# Altium schematic sheet ST_LINK_V2.SCHDOC
size A4; DocumentNumber: 2; Revision: C.1(PCB.SCH); SheetNumber: 2; SheetTotal: 4
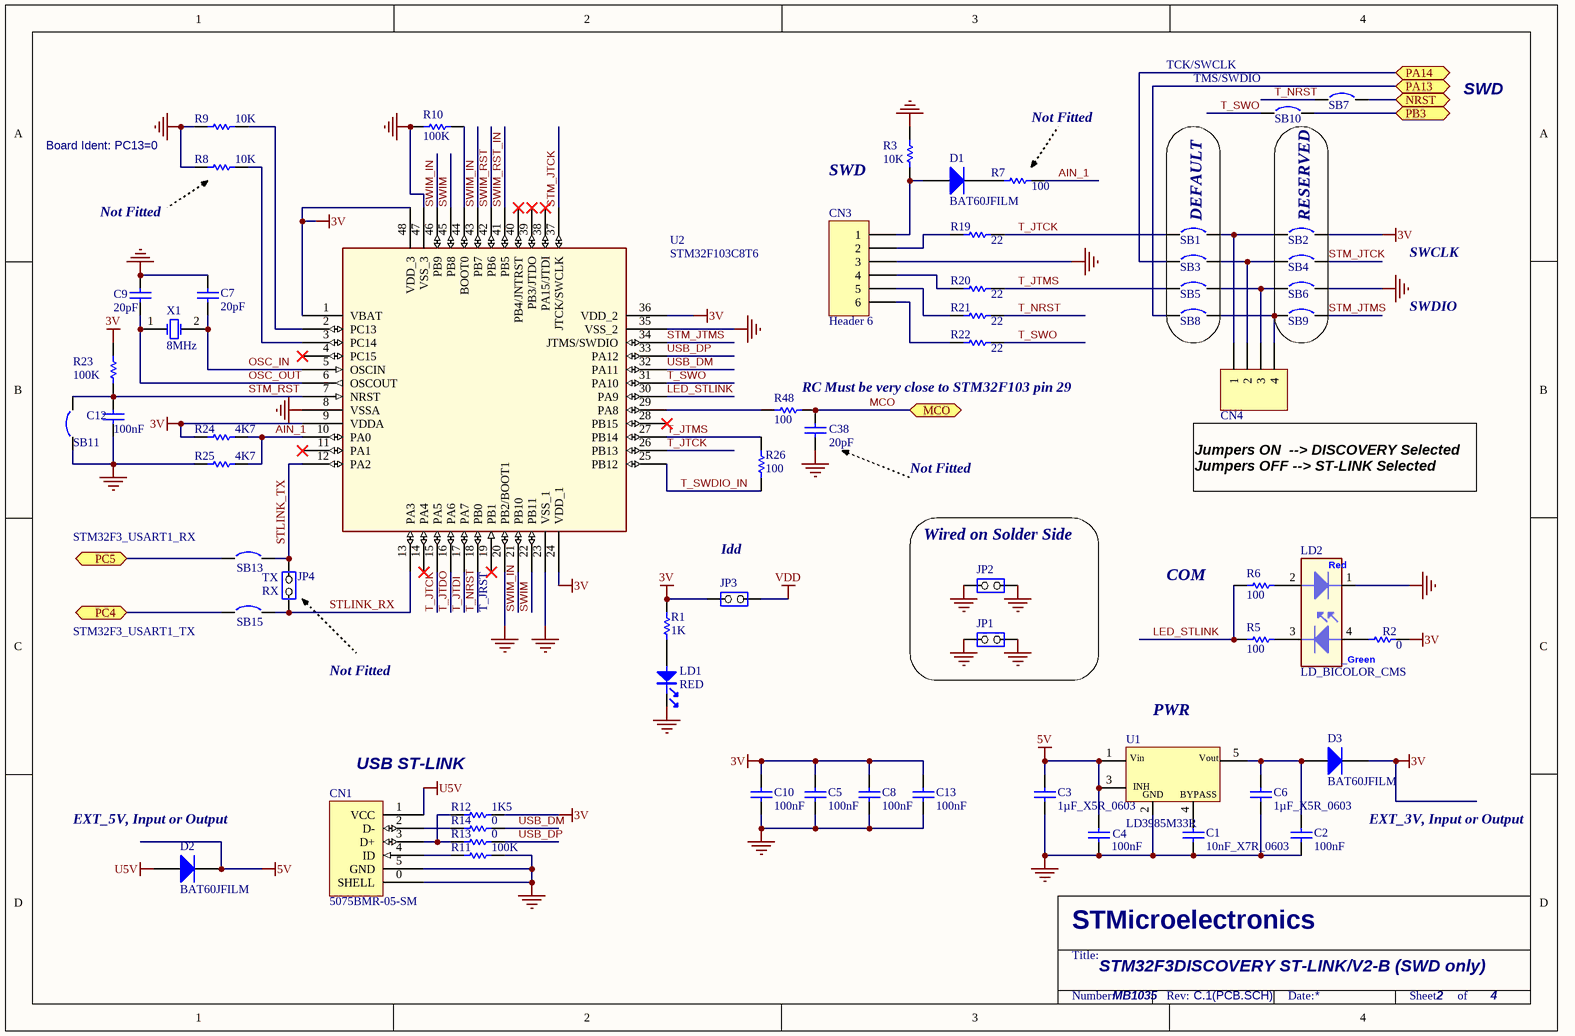
[diagram p0: ST_LINK_V2.SCHDOC]

## Parts
C1  10nF_X7R_0603  [0603C]
C2  100nF  [0603C]
C3  1µF_X5R_0603  [0603C]
C4  100nF  [0603C]
C5  100nF  [0402C]
C6  1µF_X5R_0603  [0603C]
C7  20pF  [0402C]
C8  100nF  [0402C]
C9  20pF  [0402C]
C10  100nF  [0402C]
C12  100nF  [0402C]
C13  100nF  [0402C]
C38  20pF  [0402C]
CN1  5075BMR-05-SM  [USB-MINI-B-SMD]
CN3  Header 6  [HDR1X6]
CN4  Header 4  [Header 4]  (value not drawn)
D1  BAT60JFILM  [SOD323/A]
D2  BAT60JFILM  [SOD323/A]
D3  BAT60JFILM  [SOD323/A]
JP1  (no value)  [SIP2/2.54]
JP2  (no value)  [SIP2/2.54]
JP3  (no value)  [SIP2/2.54]
JP4  JP2  [SIP2/2.54]  (value not drawn)
LD1  RED  [0603D]
LD2  LD_BICOLOR_CMS  [HSMF-A201]
R1  1K  [0402R]
R2  0  [0402R]
R3  10K  [0402R]
R5  100  [0402R]
R6  100  [0402R]
R7  100  [0402R]
R8  10K  [0402R]
R9  10K  [0402R]
R10  100K  [0402R]
R11  100K  [0402R]
R12  1K5  [0402R]
R13  0  [0402R]
R14  0  [0402R]
R19  22  [0402R]
R20  22  [0402R]
R21  22  [0402R]
R22  22  [0402R]
R23  100K  [0402R]
R24  4K7  [0402R]
R25  4K7  [0402R]
R26  100  [0402R]
R48  100  [0402R]
SB1  Circuit Breaker  [JP2_SMD]  (value not drawn)
SB2  Circuit Breaker  [JP2_SMD]  (value not drawn)
SB3  Circuit Breaker  [JP2_SMD]  (value not drawn)
SB4  Circuit Breaker  [JP2_SMD]  (value not drawn)
SB5  Circuit Breaker  [JP2_SMD]  (value not drawn)
SB6  Circuit Breaker  [JP2_SMD]  (value not drawn)
SB7  Circuit Breaker  [JP2_SMD]  (value not drawn)
SB8  Circuit Breaker  [JP2_SMD]  (value not drawn)
SB9  Circuit Breaker  [JP2_SMD]  (value not drawn)
SB10  Circuit Breaker  [JP2_SMD]  (value not drawn)
SB11  Circuit Breaker  [JP2_SMD]  (value not drawn)
SB13  Circuit Breaker  [JP2_SMD]  (value not drawn)
SB15  Circuit Breaker  [JP2_SMD]  (value not drawn)
U1  LD3985M33R  [SOT-23-5L]
U2  STM32F103C8T6  [QFP48 7X7]
X1  8MHz  [XTAL1]

## Blocks framed on the sheet
DEFAULT: SB1 SB3 SB5 SB8
RESERVED: SB2 SB4 SB6 SB9
Wired on Solder Side: JP1 JP2

## Ports
MCO, NRST, PA13, PA14, PB3, PC4, PC5

## Nets
3V: C5.2 C8.1 C10.2 C13.2 D3.2(K) JP3.1(COMMON) R1.2 R2.2 R12.2 R23.2 R24.1 SB2.2 U2.1(VBAT) U2.9(VDDA) U2.24(VDD_1) U2.36(VDD_2) U2.48(VDD_3)
5V: C3.2 C4.2 D2.2(K) U1.1(Vin) U1.3(CE)
GND: C1.1 C2.1 C3.1 C4.1 C5.1 C6.2 C7.1 C8.2 C9.1 C10.1 C12.1 C13.1 C38.2 CN1.0(SHELL) CN1.5(GND) CN3.3 JP1.1(COMMON) JP1.2(NO) JP2.1(COMMON) JP2.2(NO) LD1.2 LD2.1 R3.2 R8.1 R9.1 R10.1 R11.2 R25.1 SB6.2 SB11.1 U1.2(GND) U2.8(VSSA) U2.20(PB2/BOOT1) U2.23(VSS_1) U2.35(VSS_2) U2.47(VSS_3)
U5V: CN1.1(VCC) D2.1(A)
VDD: JP3.2(NO)
AIN_1: R7.2 R24.2 R25.2 U2.10(PA0)
LED_STLINK: R5.1 R6.1 U2.30(PA9)
MCO: C38.1 R48.2 ; port MCO
NRST: SB7.2 ; port NRST
OSC_IN: C7.2 U2.5(OSCIN) X1.2(OSC2)
OSC_OUT: C9.2 U2.6(OSCOUT) X1.1(OSC1)
PA13: SB8.1 ; port PA13
PA14: SB3.1 ; port PA14
PB3: SB10.2 ; port PB3
PC4: SB15.1 ; port PC4
PC5: SB13.1 ; port PC5
STLINK_RX: JP4.1(COMMON) SB15.2 U2.13(PA3)
STLINK_TX: JP4.2(NO) SB13.2 U2.12(PA2)
STM_JTCK: SB4.2 U2.37(JTCK/SWCLK)
STM_JTMS: SB9.2 U2.34(JTMS/SWDIO)
STM_RST: C12.2 R23.1 SB11.2 U2.7(NRST)
SWIM: U2.22(PB11) U2.45(PB8)
SWIM_IN: U2.21(PB10) U2.43(PB7) U2.46(PB9)
SWIM_RST: U2.42(PB6)
SWIM_RST_IN: U2.41(PB5)
T_JTCK: R19.2 SB1.1 U2.15(PA5) U2.26(PB13)
T_JTDI: U2.17(PA7)
T_JTDO: U2.16(PA6)
T_JTMS: R20.2 R26.2 SB5.1 U2.27(PB14)
T_NRST: R21.2 SB7.1 U2.18(PB0)
T_SWDIO_IN: R26.1 U2.25(PB12)
T_SWO: R22.2 SB10.1 U2.31(PA10)
USB_DM: R14.2 U2.32(PA11)
USB_DP: R13.2 U2.33(PA12)
NetC1_2: C1.2 U1.4(BYPASS)
NetC2_2: C2.2 C6.1 D3.1(A) U1.5(Vout)
NetCN1_2: CN1.2(D-) R14.1
NetCN1_3: CN1.3(D+) R12.1 R13.1
NetCN1_4: CN1.4(ID) R11.1
NetCN3_1: CN3.1 D1.1(A) R3.1
NetCN3_2: CN3.2 R19.1
NetCN3_4: CN3.4 R20.1
NetCN3_5: CN3.5 R21.1
NetCN3_6: CN3.6 R22.1
NetCN4_1: CN4.1 SB1.2 SB2.1
NetCN4_2: CN4.2 SB3.2 SB4.1
NetCN4_3: CN4.3 SB5.2 SB6.1
NetCN4_4: CN4.4 SB8.2 SB9.1
NetD1_2: D1.2(K) R7.1
NetLD1_1: LD1.1 R1.1
NetLD2_2: LD2.2 R6.2
NetLD2_3: LD2.3 R5.2
NetLD2_4: LD2.4 R2.1
NetR8_2: R8.2 U2.3(PC14)
NetR9_2: R9.2 U2.2(PC13)
NetR10_2: R10.2 U2.44(BOOT0)
NetR48_1: R48.1 U2.29(PA8)

Not connected (* = marked no-connect by the designer): U2 4(PC15)* 11(PA1)* 14(PA4)* 19(PB1)* 28(PB15)* 38(PA15/JTDI)* 39(PB3/JTDO)* 40(PB4/JNTRST)*

## Notes on the sheet
- TCK/SWCLK
- (near SB10) TMS/SWDIO
- SWD
- Board Ident: PC13=0
- Not Fitted
- SWCLK
- SWDIO
- (near R48) RC Must be very close to STM32F103 pin 29
- Jumpers ON  --> DISCOVERY Selected
  Jumpers OFF --> ST-LINK Selected
- STM32F3_USART1_RX
- TX
- (near JP3) Idd
- COM
- STM32F3_USART1_TX
- RX
- (near U2) T_JRST
- (near U1) PWR
- USB ST-LINK
- (near D2) EXT_5V, Input or Output
- EXT_3V, Input or Output
- STM32F3DISCOVERY ST-LINK/V2-B (SWD only)
- MB1035
- STMicroelectronics
- Title:
- Number:
- Rev:
- Date:
- Sheet       of
- (in symbol LD3985M33R) INH
- (in symbol LD_BICOLOR_CMS) Red; _Green

## Library data of the parts
C1 = CAP SMD 0603  X7R 10000PF 50V 10%: 0603  X7R 10NF; Order code RS: 2040779; Rated voltage: 50V; Tolerance: 10%; Order code Farnell: 7569548RL; Value: 10NF; Power: *; Technology: X7R; Temperature Factor: *; Temperature Min: -55°C; Temperature Max: +125°C; STS Code: *
C2 C4 C5 C7-C10 C12 C13 = Cap: Capacitor; Published: 8-Jun-2000; Revision: July-2002: Re-released for DXP Platform.; Publisher: Altium Limited
  C2 C4 C5 C8 C10 C12 C13: Value: 100nF
  C7 C9: Value: 20pF
C3 C6 = CAP SMD 0603  X5R 1µF 25V 10%: 0603  X5R 1µF; Rated voltage: 25V; Tolerance: 10%; Manufacturer: *; Manufacturer P/N: *; Order code Farnell: 1288202RL; Value: 1µF; Power: *; Technology: X5R; Temperature  Factor: *; Temperature Max: +125°C; Temperature Min: -55°C; STS Code: *
C38 = Cap: Capacitor; Fitted: NO; Published: 8-Jun-2000; Publisher: Altium Limited; Value: 20pF; Revision: July-2002: Re-released for DXP Platform.
CN1 = USB-MINI-typeB connector
CN3 = Header 6: Header, 6-Pin; LatestRevisionDate: 17-Jul-2002; LatestRevisionNote: Re-released for DXP Platform.; Publisher: Altium Limited
CN4 = Header 4: Header, 4-Pin; Revision: 17-Jul-2002: Re-released for DXP Platform.; Publisher: Altium Limited
D1-D3 = BAT60JFILM: Manuf_1: STM; Code - JEDEC: DO-214-AB; Provided: ST; Published: 8-Jun-2000; Revision: July-2002: Re-released for DXP Platform.; Publisher: Altium Limited; Order: BAT60JFILM; Manuf_Part_1: BAT60JFILM
JP1-JP3 = JP2
JP4 = JP2: Fitted: NO
LD1 = PHOTO
LD2 = LD_BICOLOR_CMS: Bicolor Led; Manuf_Part_1: HSMF-A201-A00J1; Manuf_1: Avago Technologies; Ref St: xxxxxx; cap_dec: ----; Distrib: RADIOSPARES; support: ----
R1-R3 R5 R6 R9-R12 R19-R26 R48 = res1: Resistor; Published: 8-Jun-2000; Revision: July-2002: Re-released for DXP Platform.; Publisher: Altium Limited
  R1: Value: 1K
  R2: Value: 0
  R3 R9: Value: 10K
  R5 R6 R26 R48: Value: 100
  R10 R11 R23: Value: 100K
  R12: Value: 1K5
  R19-R22: Value: 22
  R24 R25: Value: 4K7
R7 R8 = res1: Resistor; Fitted: NO; Published: 8-Jun-2000; Revision: July-2002: Re-released for DXP Platform.; Publisher: Altium Limited
  R7: Value: 100
  R8: Value: 10K
R13 R14 = res1: Resistor; Value: 1K5; Published: 8-Jun-2000; Revision: July-2002: Re-released for DXP Platform.; Publisher: Altium Limited
SB1 SB3 SB5 SB8 SB10 SB11 = Circuit Breaker: Solder: NO; Published: 24-Mar-1999; Revision: July-2002: Re-released for DXP Platform.; Publisher: Altium Limited
SB2 SB4 SB6 SB7 SB9 = Circuit Breaker: Solder: YES; Published: 24-Mar-1999; Revision: July-2002: Re-released for DXP Platform.; Publisher: Altium Limited
U1 = LD3985M33R: Ultra low drop-low noise BiCMOS voltage, regulators low ESR capacitors compatible; Manuf_1: STM; Provided: ST; Ref St: 9176161; Manuf_Part_1: LD3985M33R; Distrib: ST; Order: LD3985M33R
U2 = STM32F103C8T6: Medium-density performance line ARM-based 32-bit MCU with 64KB Flash; Manuf_1: STM; Ref St: 9175981; Provided: ST; Manuf_Part_1: STM32F103C8T6; Distrib: ST; Order: STM32F103C8T6
X1 = XTAL: Crystal Oscillator; Published: 8-Jun-2000; LatestRevisionDate: 17-Jul-2002; LatestRevisionNote: Re-released for DXP Platform.; PackageReference: R38; Publisher: Altium Limited
SB13 SB15 = Circuit Breaker: Published: 24-Mar-1999; Revision: July-2002: Re-released for DXP Platform.; Publisher: Altium Limited